# Altium project ST25RU3993_RF_MODULE.PrjPcb (part 3 of 4)

## Sheet Power_Amplifier_HP.SchDoc
size B; SheetNumber: 5; SheetTotal: 12; PageSetup: Record=PageOptions|CenterHorizontal=True|CenterVertical=True|PrintScale=0.97|XCorrection=1.00|YCorrection=1.00|PrintKind=0|BorderSize=5000000|LeftOffset=0|BottomOffset=0|Orientation=2|PaperLength=1000|PaperWidth=1000|Scale=100|PaperSource=7|PrintQuality=-4|MediaType=1|DitherType=10|PaperKind=A4|PrintScaleMode=1
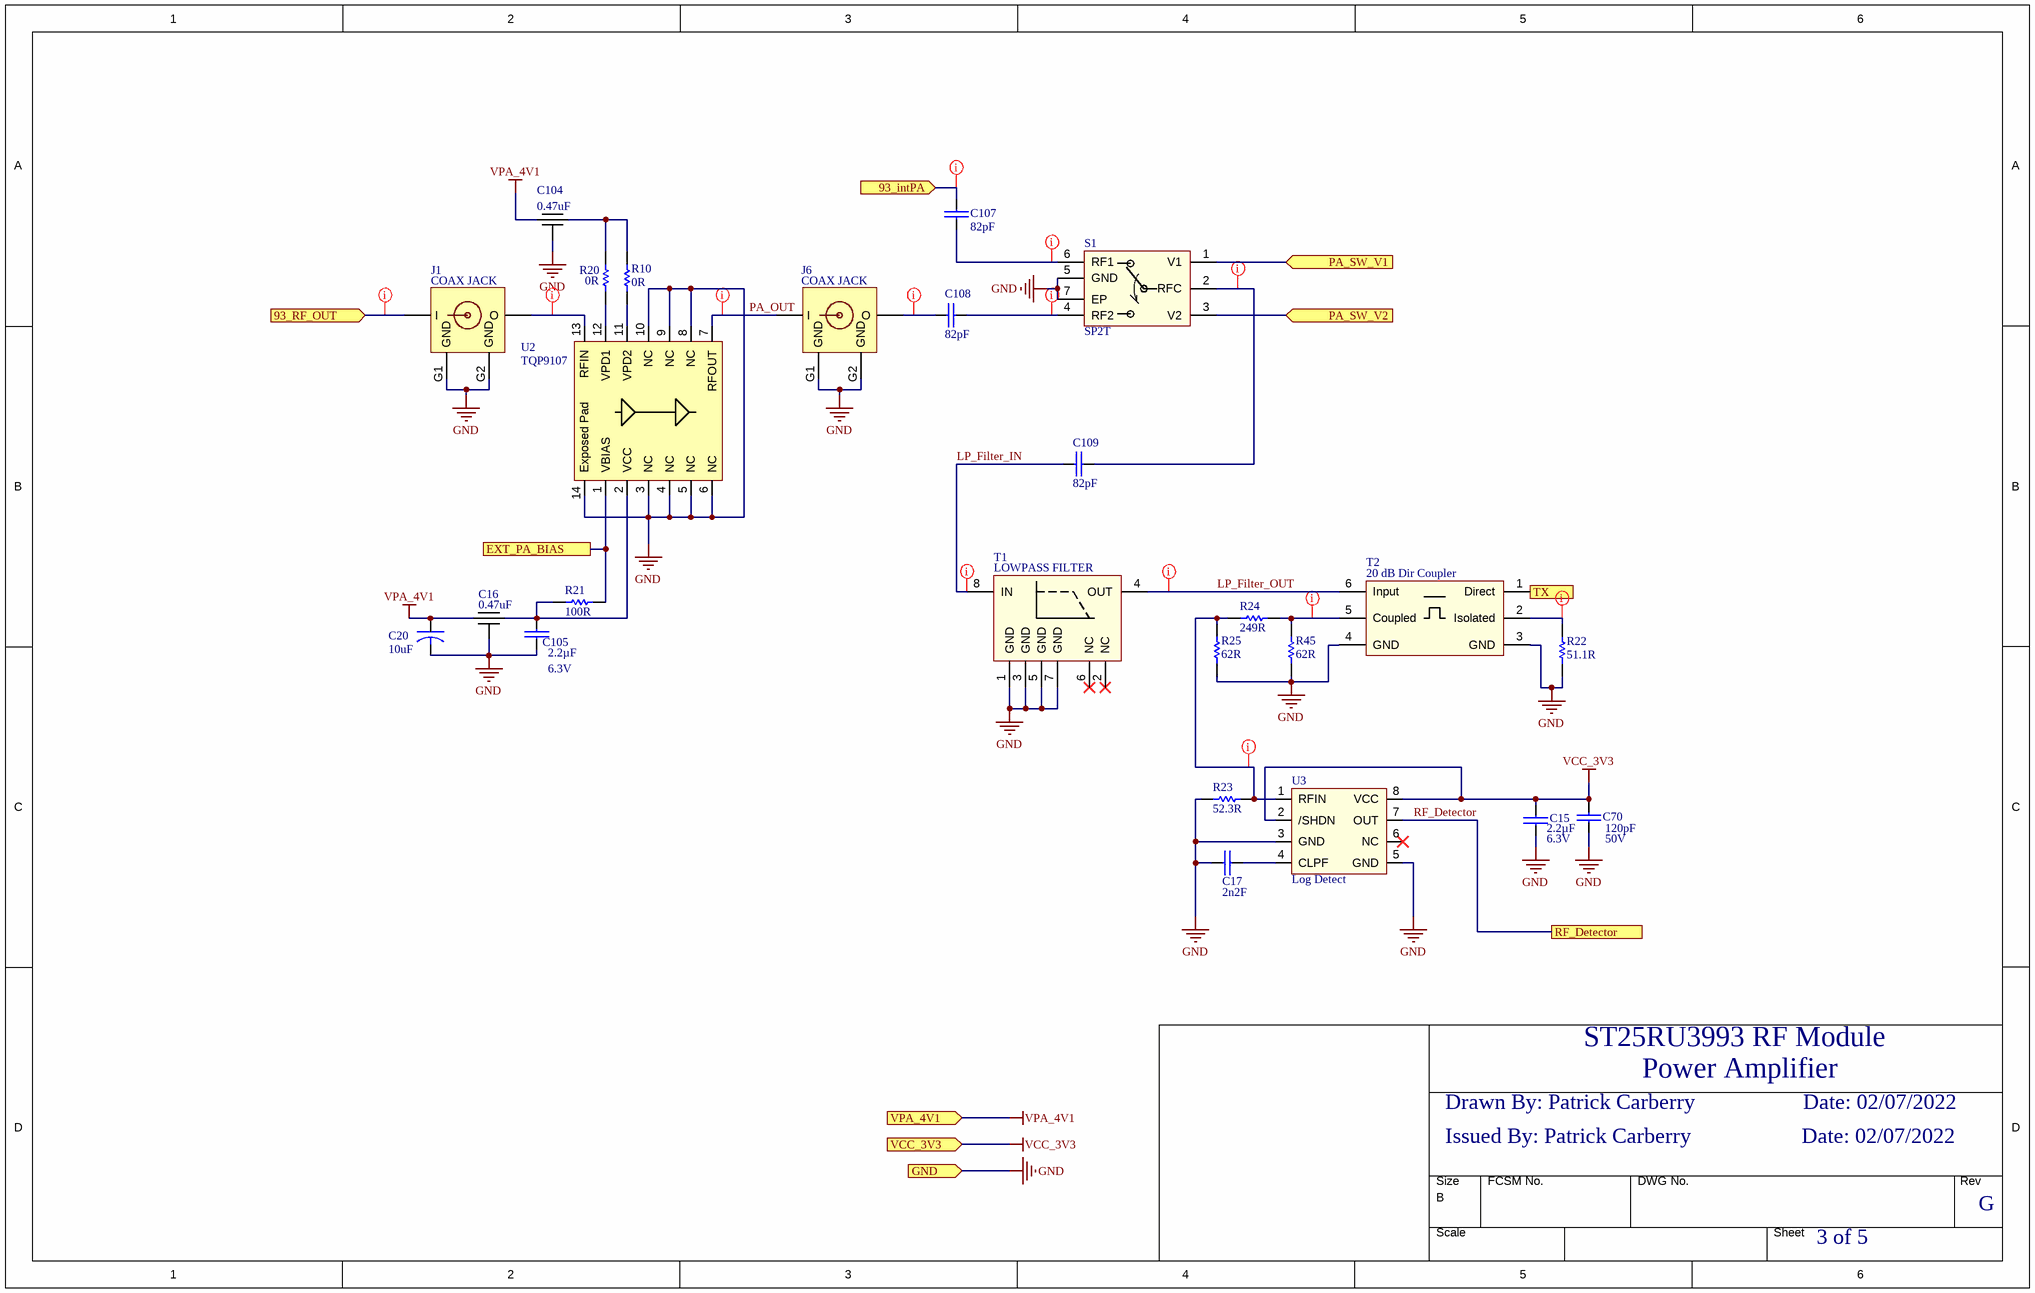
[diagram p2: Power_Amplifier_HP.SchDoc]

### Parts
C15  Capacitance: 2.2µF  Voltage - Rated: 6.3V  [C0402-RF]  (hidden comment: C0402C225K9PAC7867)
C16  0.47uF  [NFM18PS]
C17  2n2F  [C0402-RF]
C20  10uF  [2917(7343)]
C70  value 120pF  Voltage: 50V  [C0402-RF]  (hidden comment: C0402C121J5GACAUTO)
C104  0.47uF  [NFM18PS]
C105  Capacitance: 2.2µF  Voltage - Rated: 6.3V  [C0402-RF]  (hidden comment: C0402C225K9PAC7867)
C107  82pF  [C0402-RF]
C108  82pF  [C0402-RF]
C109  82pF  [C0402-RF]
J1  COAX JACK  [MS-156HF_SAW]
J6  COAX JACK  [MS-156HF]
R10  0R  [R0402-RF]
R20  0R  [R0402-RF]
R21  100R  [R0402-RF]
R22  51.1R  [R0402-RF]
R23  52.3R  [R0402-RF]
R24  249R  [R0402-RF]
R25  62R  [R0402-RF]
R45  62R  [R0402-RF]
S1  SP2T  [SKY13431-374LF]
T1  LOWPASS FILTER  [JTI-0900LP15B0063]
T2  20 dB Dir Coupler  [DC0710J5010AHF]
U2  TQP9107  [TQP9107]
U3  Log Detect  [MAX4003]

### Ports
93_intPA (in), 93_RF_OUT (in), EXT_PA_BIAS, GND (in), PA_SW_V1 (in), PA_SW_V2 (in), RF_Detector, TX (out), VCC_3V3 (in), VPA_4V1 (in)

### Nets
GND: C15.2 C16.2 C17.1 C20.2 C70.2 C104.2 C105.2 J1.G1(GND) J1.G2(GND) J6.G1(GND) J6.G2(GND) R22.1 R23.1 R25.1 R45.1 S1.5(GND) S1.7(EP) T1.1(GND) T1.3(GND) T1.5(GND) T1.7(GND) T2.3(GND) T2.4(GND) U2.3(NC) U2.4(NC) U2.5(NC) U2.6(NC) U2.8(NC) U2.9(NC) U2.10(NC) U2.14(Exposed_Pad) U3.3(GND) U3.5(GND) ; port GND
VCC_3V3: C15.1 C70.1 U3.2(/SHDN) U3.8(VCC) ; port VCC_3V3
VPA_4V1: C16.3 C20.1 C104.1 ; port VPA_4V1
LP_Filter_IN: C109.2 T1.8(IN)
LP_Filter_OUT: T1.4(OUT) T2.6(Input)
PA_OUT: J6.IN(I) U2.7(RFOUT)
PA_SW_V1: S1.1(V1) ; port PA_SW_V1
PA_SW_V2: S1.3(V2) ; port PA_SW_V2
RF_DETECTOR: U3.7(OUT) ; port RF_Detector
NetC16_1: C16.1 C105.1 R21.1 U2.2(VCC)
NetC17_2: C17.2 U3.4(CLPF)
NetC104_3: C104.3 R10.2 R20.2
NetC107_1: C107.1 ; port 93_intPA
NetC107_2: C107.2 S1.6(RF1)
NetC108_1: C108.1 S1.4(RF2)
NetC108_2: C108.2 J6.OUT(O)
NetC109_1: C109.1 S1.2(RFC)
NetJ1_IN: J1.IN(I) ; port 93_RF_OUT
NetJ1_OUT: J1.OUT(O) U2.13(RFIN)
NetR10_1: R10.1 U2.11(VPD2)
NetR20_1: R20.1 U2.12(VPD1)
NetR21_2: R21.2 U2.1(VBIAS) ; port EXT_PA_BIAS
NetR22_2: R22.2 T2.2(Isolated)
NetR23_2: R23.2 R24.1 R25.2 U3.1(RFIN)
NetR24_2: R24.2 R45.2 T2.5(Coupled)
NetT2_1: T2.1(Direct) ; port TX

Not connected (* = marked no-connect by the designer): T1 2(NC)* 6(NC)*; U3 6(NC)*

### Layout directives
net class SE_CPWG: LP_Filter_IN, LP_Filter_OUT, NetC107_1, NetC107_2, NetC108_1, NetC108_2, NetC109_1, NetJ1_IN, NetJ1_OUT, NetR22_2, NetR23_2, NetR24_2, PA_OUT

### Notes on the sheet
- Drawn By: Patrick Carberry
- ST25RU3993 RF Module
- Power Amplifier
- Date: 02/07/2022
- Issued By: Patrick Carberry
- 3 of 5
- G

### Library data of the parts
C15 C105 = CAP_2.2UF_6.3V_10%_X5R_0402: Manufacturer: KEMET; Tolerance: 10%; Temperature Coefficient: X5R; Thickness (Max): 0.014" (0.35mm); ComponentLink1URL: https://connect.kemet.com:7667/gateway/IntelliData-ComponentDocumentation/1.0/download/datasheet/C0402C225K9PACTU; ComponentLink1Description: http://www.murata.com/~/media/webrenewal/support/library/catalog/products/capacitor/mlcc/c02e.pdf; Manufacturer Part Number: C0402C225K9PAC7867
C16 C104 = NFM18PS474R0J3D: CAP FEEDTHRU 0.47UF 6.3V 0603; Manufacturer: Murata Electronics North America; Capacitance: 0.47µF; Tolerance: ±20%; Current: 2A; DC Resistance (DCR) (Max): 30 mOhm; Type: Polymer; ESR (Equivalent Series Resistance): 70 mOhm; Lifetime @ Temp.: 1000 Hrs @ 105°C; Ripple Current - High Frequency: 1A @ 100kHz; Surface Mount Land Size: 0.287" L x 0.169" W (7.30mm x 4.30mm); Exact Component Match: no; Supplier 1: Digi-Key; Manufacturer Part Number: NFM18PS474R0J3D; RoHS: RoHS Compliant; Category: Filters; Stock: 926; Pricing 1: 1=0.14, 10=0.132, 25=0.1264, 50=0.122, 100=0.1181, 250=0.11192, 500=0.09362, 1000=0.07267 (EUR); Packaging: Cut Tape (CT); Part Status: Active; Voltage - Rated: 6.3V; Operating Temperature: -55°C ~ 125°C; Insertion Loss: -; Temperature Coefficient: -; Ratings: -; Mounting Type: Surface Mount; Package / Case: 0603 (1608 Metric), 3 PC Pad; Size / Dimension: 0.063" L x 0.031" W (1.60mm x 0.80mm); Height (Max): 0.028" (0.70mm); Thread Size: -; ComponentLink1URL: http://search.murata.co.jp/Ceramy/image/img/A01X/G101/ENG/NFM18PS474R0J3-01.pdf; ComponentLink1Description: http://search.murata.co.jp/Ceramy/image/img/A01X/G101/ENG/NFM18PS474R0J3-01.pdf; Supplier Part Number 1: 490-6975-1-ND; Supplier 2: Digi-Key; Pricing 2: 1=1.25, 10=0.984, 100=0.7379, 500=0.55756, 1000=0.49196 (EUR); Applications: General Purpose; Ripple Current - Low Frequency: -; Lead Spacing: -; Height - Seated (Max): 0.075" (1.90mm); ComponentLink2URL: http://www.murata.com/~/media/webrenewal/support/library/catalog/products/capacitor/polymer/c90e.ashx; ComponentLink2Description: http://www.murata.com/~/media/webrenewal/support/library/catalog/products/capacitor/polymer/c90e.ashx; Supplier Part Number 2: 490-5481-1-ND
C17 = GRM155R71H222KA01D (2): CAP CER 2.2NF 50V X7R 0402; Manufacturer: Murata Electronics North America; Tolerance: ±10%; Notification: Current market demand for these product types have resulted in fluctuating and extending lead times. Lead times may differ.; Exact Component Match: no; Supplier 1: Digi-Key; Supplier Part Number 1: 490-1305-1-ND; Manufacturer Part Number: GRM155R71H222KA01D; RoHS: RoHS Compliant; Category: Capacitors; Stock: 254292; Pricing: 1=0.08, 10=0.013, 100=0.0054, 500=0.00386, 1000=0.00304, 2500=0.00276, 5000=0.00254 (EUR); Packaging: Cut Tape (CT); Part Status: Active; Voltage - Rated: 50V; Temperature Coefficient: X7R; Operating Temperature: -55°C ~ 125°C; Features: -; Ratings: -; Applications: General Purpose; Mounting Type: Surface Mount, MLCC; Package / Case: 0402 (1005 Metric); Size / Dimension: 0.039" L x 0.020" W (1.00mm x 0.50mm); Height - Seated (Max): -; Thickness (Max): 0.022" (0.55mm); Lead Spacing: -; Lead Style: -; ComponentLink1URL: https://www.murata.com/~/media/webrenewal/support/library/catalog/products/capacitor/mlcc/c02e.ashx?la=en-us; ComponentLink1Description: https://www.murata.com/~/media/webrenewal/support/library/catalog/products/capacitor/mlcc/c02e.ashx?la=en-us
C20 = ECASD41C106M060K00: CAP POLYMER 10UF 20% 16V SMD; Manufacturer: Murata; Product Training Modules: Polymer Aluminum Electrolytic Capacitors Using Murata's Polymer Aluminum Capacitors to Replace Tantalum; Catalog Drawings: ECAS Series End_D4 ECAS Series Side; Featured Product: ECAS Series Polymer Aluminum Electrolytic Capacitors; EDA / CAD Models: Download from Accelerated Designs; Capacitance: 10µF; ESR (Equivalent Series Resistance): 60 mOhm @ 100kHz; Lifetime @ Temp.: 1000 Hrs @ 105°C; Polarization: Polar; Ripple Current: 1A; Surface Mount Land Size: 0.287" L x 0.169" W (7.30mm x 4.30mm); Online Catalog: ECAS Series; Other Names: 490-5482-2; Supplier 2: Distrelec; Manufacturer Part Number: ECASD41C106M060K00; Stock: 2288; Pricing 1: 1=0.51, 50=0.46, 250=0.41 (EUR); Standard Package: 3,000; Category: Capacitors; Family: Aluminum - Polymer Capacitors; Series: ECAS; Packaging: Tape & Reel (TR); Tolerance: ±20%; Voltage Rating: 16V; Operating Temperature: -40°C ~ 105°C; Applications: General Purpose; Size / Dimension: 0.287" L x 0.169" W (7.30mm x 4.30mm); Height - Seated (Max): 0.075" (1.90mm); Mounting Type: Surface Mount; Package / Case: 2917 (7343 Metric); ComponentLink1URL: https://datasheet.ciiva.com/93/c90e-93987.pdf; ComponentLink1Description: https://datasheet.ciiva.com/93/c90e-93987.pdf; ComponentLink2URL: https://datasheet.ciiva.com/26889/getdatasheetpartid-716590-26889066.pdf; ComponentLink2Description: https://datasheet.ciiva.com/26889/getdatasheetpartid-716590-26889066.pdf; ComponentLink3URL: https://datasheet.ciiva.com/93/c90e-93985.pdf; ComponentLink3Description: https://datasheet.ciiva.com/93/c90e-93985.pdf; ComponentLink4URL: https://datasheet.ciiva.com/93/c90e-93986.pdf; ComponentLink4Description: https://datasheet.ciiva.com/93/c90e-93986.pdf; ComponentLink5URL: https://datasheet.ciiva.com/14113/ecas-eng-ds-14113434.pdf; ComponentLink5Description: https://datasheet.ciiva.com/14113/ecas-eng-ds-14113434.pdf; Supplier Part Number 2: 16705082; Supplier 1: Digi-Key; Supplier Part Number 1: 490-5482-1-ND
C70 = CAP_120PF_50V_5%_C0G_0402: CAP CER 120PF 50V C0G/NP0 0402; Manufacturer: KEMET; Manufacturer Part Number: C0402C121J5GACAUTO; ComponentLink1URL: https://content.kemet.com/datasheets/KEM_C1022_C0G_AUTO_SMD.pdf; ComponentLink1Description: http://search.murata.co.jp/Ceramy/image/img/A01X/G101/ENG/GRM0335C1H121JA01-01.pdf
C107-C109 = GRM1555C1H820GA01J: CAP CER 82PF 50V C0G/NP0 0402; Manufacturer: Murata Electronics North America; Tolerance: ±2%; Temperature Coefficient: C0G, NP0; Filter Type: Signal Line; Number of Lines: 1; Impedance @ Frequency: 1 kOhm @ 100MHz; Current Rating (Max): 250mA; DC Resistance (DCR) (Max): 1.1 Ohm; Type: Zener; Voltage - Reverse Standoff (Typ): 3V; Voltage - Breakdown (Min): 6V; Voltage - Clamping (Max) @ Ipp: 17V; Current - Peak Pulse (10/1000µs): 1A (8/20µs); Power - Peak Pulse: 40W; Power Line Protection: No; Capacitance @ Frequency: 0.4pF @ 200MHz ~ 3GHz; Supplier 1: Digi-Key; Supplier Part Number 1: 490-7760-1-ND; Manufacturer Part Number: GRM1555C1H820GA01J; RoHS: RoHS Compliant; Category: Capacitors; Stock: 52112; Pricing: 1=0.08, 10=0.042, 100=0.0189, 500=0.01352, 1000=0.01063, 2500=0.00966, 5000=0.00889 (EUR); Packaging: Cut Tape (CT); Part Status: Active; Voltage - Rated: 50V; Operating Temperature: -55°C ~ 125°C; Features: -; Ratings: -; Applications: General Purpose; Mounting Type: Surface Mount, MLCC; Package / Case: 0402 (1005 Metric); Size / Dimension: 0.039" L x 0.020" W (1.00mm x 0.50mm); Height - Seated (Max): -; Thickness (Max): 0.022" (0.55mm); Lead Spacing: -; Lead Style: -; ComponentLink1URL: http://www.murata.com/~/media/webrenewal/support/library/catalog/products/capacitor/mlcc/c02e.ashx; ComponentLink1Description: http://www.murata.com/~/media/webrenewal/support/library/catalog/products/capacitor/mlcc/c02e.ashx; Supplier 2: Digi-Key; Supplier Part Number 2: 490-3999-1-ND; Height (Max): 0.022" (0.55mm); ComponentLink2URL: http://www.murata.com/en-global/products/productdata/8796740223006/ENFA0024.pdf; ComponentLink2Description: http://www.murata.com/en-global/products/productdata/8796740223006/ENFA0024.pdf; Supplier 3: Digi-Key; Supplier Part Number 3: 497-13413-1-ND; Supplier Device Package: SOD-882T; ComponentLink3URL: http://www.st.com/content/ccc/resource/technical/document/datasheet/e8/d2/ed/fd/e8/00/4a/29/DM00065056.pdf/files/DM00065056.pdf/jcr:content/translations/en.DM00065056.pdf; ComponentLink3Description: http://www.st.com/content/ccc/resource/technical/document/datasheet/e8/d2/ed/fd/e8/00/4a/29/DM00065056.pdf/files/DM00065056.pdf/jcr:content/translations/en.DM00065056.pdf; Exact Component Match: no
J1 = MS-156HF_SAW: CONN COAX JACK STR 50 OHM SMD; Manufacturer 1: Hirose Electric Co Ltd; Manufacturer Part Number 1: MS-156HF(01); Connector Style: Coaxial Switch - 4mm Plug Dia; Connector Type: Receptacle, Female Socket; Contact Termination: Solder; Impedance: 50 Ohm; Frequency - Max: 6GHz; Body Material: Phosphor Bronze; Body Finish: Gold; Center Contact Material: Beryllium Copper; Dielectric Material: Polyamide (PA), Nylon 6T; Coupler Type: Standard; Frequency: 700MHz ~ 1GHz; Coupling Factor: 10.9dB; Insertion Loss: 0.21dB; Power - Max: 2W; Return Loss: 17.5dB; Exact Component Match: no; Capacitance: 2.2µF; Tolerance: ±20%; Voltage - Rated: 10V; Current: 4A; DC Resistance (DCR) (Max): 10 mOhm; Material - Core: Air; Shielding: Unshielded; DC Resistance (DCR): 1.25 Ohm Max; Supplier 1: Digi-Key; Supplier Part Number 1: H11669-ND; RoHS: RoHS Compliant; Category: Connectors, Interconnects; Stock 1: 10; Pricing 1: 1=0.84, 10=0.735, 25=0.6912, 50=0.6626, 100=0.6337, 250=0.57612, 500=0.51852, 1000=0.4609, 2500=0.41769 (EUR); Packaging: Bulk; Part Status: Active; Shield Termination: Solder; Mounting Type: Surface Mount; Cable Group: -; Fastening Type: Snap-On; Features: Internal Switch; Housing Color: Gold; Ingress Protection: -; Center Contact Plating: Gold; Voltage Rating: -; Operating Temperature: -40°C ~ 85°C; ComponentLink1URL: https://www.hirose.com/product/en/download_file/key_name/MS-156HF/category/Catalog/doc_file_id/49714/?file_category_id=4&item_id=394&is_series=1; ComponentLink1Description: https://www.hirose.com/product/en/download_file/key_name/MS-156HF/category/Catalog/doc_file_id/49714/?file_category_id=4&item_id=394&is_series=1; Supplier 2: Digi-Key; Supplier Part Number 2: 1173-1084-1-ND; Manufacturer 2: Anaren; Manufacturer Part Number 2: DC0710J5010AHF; Stock 2: 8788; Pricing 2: 1=0.82, 10=0.735, 25=0.648, 100=0.5833, 250=0.50772, 500=0.4537 (EUR); Applications: General Purpose; Isolation: -; Package / Case: 0805 (2012 Metric); Supplier Device Package: 0805; ComponentLink2URL: https://www.anaren.com/sites/default/files/Part-Datasheets/DC0710J5010AHF_Datasheet_RevA.pdf; ComponentLink2Description: https://www.anaren.com/sites/default/files/Part-Datasheets/DC0710J5010AHF_Datasheet_RevA.pdf; Manufacturer: Hirose Electric Co Ltd; Manufacturer Part Number: MS-156HF(01); Supplier 3: Digi-Key; Stock: 3361; Pricing 3: 1=0.25, 10=0.237, 25=0.2256, 50=0.2184, 100=0.2112, 250=0.20028, 500=0.1675, 1000=0.12999 (EUR); Temperature Coefficient: -; Ratings: -; Size / Dimension: 0.063" L x 0.031" W (1.60mm x 0.80mm); Height (Max): 0.028" (0.70mm); Thread Size: -; ComponentLink3URL: http://search.murata.co.jp/Ceramy/image/img/A01X/G101/ENG/NFM18PC225B1A3-01.pdf; ComponentLink3Description: http://search.murata.co.jp/Ceramy/image/img/A01X/G101/ENG/NFM18PC225B1A3-01.pdf; Supplier 4: Digi-Key; Supplier Part Number 4: 490-15137-1-ND; Pricing: 1=0.08, 10=0.064, 100=0.0424, 500=0.0354, 1000=0.02973, 2500=0.02548 (EUR); Type: Multilayer; Height - Seated (Max): 0.022" (0.55mm); ComponentLink4URL: http://search.murata.co.jp/Ceramy/image/img/P02/JELF243B-0010.pdf; ComponentLink4Description: http://search.murata.co.jp/Ceramy/image/img/P02/JELF243B-0010.pdf; Supplier Part Number 3: 490-6972-1-ND
J6 = MS-156HF: CONN COAX JACK STR 50 OHM SMD; Manufacturer 1: Hirose Electric Co Ltd; Manufacturer Part Number 1: MS-156HF(01); Connector Style: Coaxial Switch - 4mm Plug Dia; Connector Type: Receptacle, Female Socket; Contact Termination: Solder; Impedance: 50 Ohm; Frequency - Max: 6GHz; Body Material: Phosphor Bronze; Body Finish: Gold; Center Contact Material: Beryllium Copper; Dielectric Material: Polyamide (PA), Nylon 6T; Coupler Type: Standard; Frequency: 700MHz ~ 1GHz; Coupling Factor: 10.9dB; Insertion Loss: 0.21dB; Power - Max: 2W; Return Loss: 17.5dB; Exact Component Match: no; Supplier 1: Digi-Key; Supplier Part Number 1: H11669-ND; RoHS: RoHS Compliant; Category: Connectors, Interconnects; Stock 1: 10; Pricing 1: 1=0.84, 10=0.735, 25=0.6912, 50=0.6626, 100=0.6337, 250=0.57612, 500=0.51852, 1000=0.4609, 2500=0.41769 (EUR); Packaging: Bulk; Part Status: Active; Shield Termination: Solder; Mounting Type: Surface Mount; Cable Group: -; Fastening Type: Snap-On; Features: Internal Switch; Housing Color: Gold; Ingress Protection: -; Center Contact Plating: Gold; Voltage Rating: -; Operating Temperature: -40°C ~ 85°C; ComponentLink1URL: https://www.hirose.com/product/en/download_file/key_name/MS-156HF/category/Catalog/doc_file_id/49714/?file_category_id=4&item_id=394&is_series=1; ComponentLink1Description: https://www.hirose.com/product/en/download_file/key_name/MS-156HF/category/Catalog/doc_file_id/49714/?file_category_id=4&item_id=394&is_series=1; Supplier 2: Digi-Key; Supplier Part Number 2: 1173-1084-1-ND; Manufacturer 2: Anaren; Manufacturer Part Number 2: DC0710J5010AHF; Stock 2: 8788; Pricing 2: 1=0.82, 10=0.735, 25=0.648, 100=0.5833, 250=0.50772, 500=0.4537 (EUR); Applications: General Purpose; Isolation: -; Package / Case: 0805 (2012 Metric); Supplier Device Package: 0805; ComponentLink2URL: https://www.anaren.com/sites/default/files/Part-Datasheets/DC0710J5010AHF_Datasheet_RevA.pdf; ComponentLink2Description: https://www.anaren.com/sites/default/files/Part-Datasheets/DC0710J5010AHF_Datasheet_RevA.pdf; Manufacturer: Hirose Electric Co Ltd; Manufacturer Part Number: MS-156HF(01)
R10 R20 = RC0402JR-070RL: RES SMD 0.0OHM JUMPER 1/16W 0402; Manufacturer: Yageo; Resistance (Ohms): 0.0; Power (Watts): 0.063W, 1/16W; Exact Component Match: no; Supplier 1: Digi-Key; Supplier Part Number 1: 311-0.0JRDKR-ND; Manufacturer Part Number: RC0402JR-070RL; RoHS: RoHS Compliant; Category: Resistors; Stock 1: 13423202; Pricing 1: 1=0.09, 10=0.012, 25=0.0084, 100=0.0048, 250=0.0036, 500=0.00288, 1000=0.00212, 2500=0.00184, 5000=0.00152 (EUR); Packaging: Digi-Reel®; Part Status: Active; Tolerance: Jumper; Composition: Thick Film; Features: Moisture Resistant; Temperature Coefficient: -; Operating Temperature: -55°C ~ 155°C; Package / Case: 0402 (1005 Metric); Supplier Device Package: 0402; Size / Dimension: 0.039" L x 0.020" W (1.00mm x 0.50mm); Height - Seated (Max): 0.016" (0.40mm); Number of Terminations: 2; Failure Rate: -; ComponentLink1URL: http://www.yageo.com/NewPortal/yageodocoutput?fileName=/pdf/R-Chip/PYu-RC_Group_51_RoHS_L_4.pdf; ComponentLink1Description: http://www.yageo.com/NewPortal/yageodocoutput?fileName=/pdf/R-Chip/PYu-RC_Group_51_RoHS_L_4.pdf; Manufacturer 1: Yageo; Manufacturer Part Number 1: RC0402JR-070RL
R21 = RC0402FR-07100RL: RES SMD 100 OHM 1% 1/16W 0402; Manufacturer: Yageo; Resistance (Ohms): 100; Power (Watts): 0.063W, 1/16W; Temperature Coefficient: ±100ppm/°C; Exact Component Match: no; Supplier 1: Digi-Key; Supplier Part Number 1: 311-100LRCT-ND; Manufacturer Part Number: RC0402FR-07100RL; RoHS: RoHS Compliant; Category: Resistors; Stock 1: 1895343; Pricing 1: 1=0.09, 10=0.012, 25=0.0088, 100=0.0049, 250=0.00372, 500=0.00296, 1000=0.00218, 2500=0.00189, 5000=0.00156 (EUR); Packaging: Cut Tape (CT); Part Status: Active; Tolerance: ±1%; Composition: Thick Film; Features: Moisture Resistant; Operating Temperature: -55°C ~ 155°C; Package / Case: 0402 (1005 Metric); Supplier Device Package: 0402; Size / Dimension: 0.039" L x 0.020" W (1.00mm x 0.50mm); Height - Seated (Max): 0.016" (0.40mm); Number of Terminations: 2; Failure Rate: -; ComponentLink1URL: http://www.yageo.com/NewPortal/yageodocoutput?fileName=/pdf/R-Chip/PYu-RC_Group_51_RoHS_L_4.pdf; ComponentLink1Description: http://www.yageo.com/NewPortal/yageodocoutput?fileName=/pdf/R-Chip/PYu-RC_Group_51_RoHS_L_4.pdf; Manufacturer 1: Yageo; Manufacturer Part Number 1: RC0402FR-07100RL
R22 = RC0402FR-0751R1L: RES SMD 51.1 OHM 1% 1/16W 0402; Manufacturer: Yageo; Power (Watts): 0.063W, 1/16W; Temperature Coefficient: ±100ppm/°C; Exact Component Match: no; Supplier 1: Digi-Key; Supplier Part Number 1: 311-51.1LRCT-ND; Manufacturer Part Number: RC0402FR-0751R1L; RoHS: RoHS Compliant; Category: Resistors; Stock: 237958; Pricing: 1=0.08, 10=0.012, 100=0.0048, 1000=0.00215, 2500=0.00186, 5000=0.00154 (EUR); Packaging: Cut Tape (CT); Part Status: Active; Tolerance: ±1%; Composition: Thick Film; Features: Moisture Resistant; Operating Temperature: -55°C ~ 155°C; Package / Case: 0402 (1005 Metric); Supplier Device Package: 0402; Size / Dimension: 0.039" L x 0.020" W (1.00mm x 0.50mm); Height - Seated (Max): 0.016" (0.40mm); Failure Rate: -; ComponentLink1URL: http://www.yageo.com/documents/recent/PYu-RC_Group_51_RoHS_L_7.pdf; ComponentLink1Description: http://www.yageo.com/documents/recent/PYu-RC_Group_51_RoHS_L_7.pdf
R23 = ERJ2RKF52R3X: RES SMD 52R3 1% 0.1W 0402; Manufacturer: Panasonic Electronic Components; Manufacturer Part Number: ERJ-2RKF52R3X; Power (Watts): 0.1W, 1/10W; Temperature Coefficient: ±100ppm/°C; Exact Component Match: no; Supplier 1: Digi-Key; Supplier Part Number 1: P52.3LCT-ND; RoHS: RoHS Compliant; Category: Resistors; Stock: 2033; Pricing: 1=0.08, 10=0.036, 100=0.0147, 1000=0.00662, 2500=0.00574, 5000=0.00474 (EUR); Packaging: Cut Tape (CT); Part Status: Active; Tolerance: ±1%; Composition: Thick Film; Features: Automotive AEC-Q200; Operating Temperature: -55°C ~ 155°C; Package / Case: 0402 (1005 Metric); Supplier Device Package: 0402; Size / Dimension: 0.039" L x 0.020" W (1.00mm x 0.50mm); Height - Seated (Max): 0.016" (0.40mm); Failure Rate: -; ComponentLink1URL: https://industrial.panasonic.com/cdbs/www-data/pdf/RDA0000/AOA0000C304.pdf; ComponentLink1Description: https://industrial.panasonic.com/cdbs/www-data/pdf/RDA0000/AOA0000C304.pdf
R24 = RC0402FR-07249RL: RES SMD 249 OHM 1% 1/16W 0402; Manufacturer: Yageo; Power (Watts): 0.063W, 1/16W; Temperature Coefficient: ±100ppm/°C; Exact Component Match: no; Supplier 1: Digi-Key; Supplier Part Number 1: 311-249LRCT-ND; Manufacturer Part Number: RC0402FR-07249RL; RoHS: RoHS Compliant; Category: Resistors; Stock: 376482; Pricing: 1=0.08, 10=0.012, 100=0.0048, 1000=0.00215, 2500=0.00186, 5000=0.00154 (EUR); Packaging: Cut Tape (CT); Part Status: Active; Tolerance: ±1%; Composition: Thick Film; Features: Moisture Resistant; Operating Temperature: -55°C ~ 155°C; Package / Case: 0402 (1005 Metric); Supplier Device Package: 0402; Size / Dimension: 0.039" L x 0.020" W (1.00mm x 0.50mm); Height - Seated (Max): 0.016" (0.40mm); Failure Rate: -; ComponentLink1URL: http://www.yageo.com/documents/recent/PYu-RC_Group_51_RoHS_L_7.pdf; ComponentLink1Description: http://www.yageo.com/documents/recent/PYu-RC_Group_51_RoHS_L_7.pdf
R25 R45 = RC0402FR-0762RL: RES SMD 62 OHM 1% 1/16W 0402; Manufacturer: Yageo; Power (Watts): 0.063W, 1/16W; Temperature Coefficient: ±100ppm/°C; Exact Component Match: no; Supplier 1: Digi-Key; Supplier Part Number 1: 311-62.0LRCT-ND; Manufacturer Part Number: RC0402FR-0762RL; RoHS: RoHS Compliant; Category: Resistors; Stock: 191216; Pricing: 1=0.08, 10=0.012, 100=0.0048, 1000=0.00215, 2500=0.00186, 5000=0.00154 (EUR); Packaging: Cut Tape (CT); Part Status: Active; Tolerance: ±1%; Composition: Thick Film; Features: Moisture Resistant; Operating Temperature: -55°C ~ 155°C; Package / Case: 0402 (1005 Metric); Supplier Device Package: 0402; Size / Dimension: 0.039" L x 0.020" W (1.00mm x 0.50mm); Height - Seated (Max): 0.016" (0.40mm); Failure Rate: -; ComponentLink1URL: http://www.yageo.com/documents/recent/PYu-RC_Group_51_RoHS_L_7.pdf; ComponentLink1Description: http://www.yageo.com/documents/recent/PYu-RC_Group_51_RoHS_L_7.pdf
S1 = SKY13431-374LF: IC SWITCH SP2T; Manufacturer: Skyworks Solutions Inc.; Frequency - Lower: 500MHz; Isolation @ Frequency: 20dB @ 5.8GHz (typ); Insertion Loss @ Frequency: 0.8dB @ 5.8GHz; IIP3: 57dBm (typ); Circuit: SPDT; P1dB: 36dBm; Impedance: 50 Ohm; Voltage - Supply: 2.5 V ~ 5 V; RF Type: WiMax, WLAN; Exact Component Match: no; Supplier 1: Digi-Key; Supplier Part Number 1: 863-1651-1-ND; Manufacturer Part Number: SKY13431-374LF; RoHS: RoHS Compliant; Category: RF/IF and RFID; Stock: 3887; Pricing: 1=1.28, 10=1.144, 100=0.8921, 500=0.73694, 1000=0.5818 (EUR); Packaging: Cut Tape (CT); Part Status: Active; Topology: -; Features: -; Operating Temperature: -40°C ~ 85°C; Package / Case: 6-XFDFN Exposed Pad; Supplier Device Package: 6-DFN (1.5x1.5); ComponentLink1URL: http://www.skyworksinc.com/uploads/documents/SKY13431_374LF_201649C.pdf; ComponentLink1Description: http://www.skyworksinc.com/uploads/documents/SKY13431_374LF_201649C.pdf
T1 = 0900LP15B0063: FILTER LOWPASS 863-960MHZ; Manufacturer: Johanson Technology Inc.; Manufacturer Part Number: 0900LP15B0063E; Exact Component Match: no; Supplier 1: Digi-Key; Supplier Part Number 1: 712-1635-1-ND; RoHS: RoHS Compliant; Category: Filters; Stock: 11994; Pricing: 1=0.44, 10=0.404, 25=0.3852, 50=0.373, 100=0.3605, 250=0.34176, 500=0.28586, 1000=0.22184 (EUR); Part Status: Active; ComponentLink1URL: https://www.johansontechnology.com/datasheets/low-pass-filters/0900LP15B0063.pdf; ComponentLink1Description: https://www.johansontechnology.com/datasheets/low-pass-filters/0900LP15B0063.pdf
T2 = DC0710J5020AHF: COUPLER 20DB 700-1000MHZ 0805; Manufacturer: Anaren; Frequency: 700MHz; Insertion Loss: 0.22dB; Max Power Dissipation: 2W; Return Loss: 21.41dB; Manufacturer Part Number: DC0710J5020AHF; Stock 1: 12905; RoHS: Yes; Mount: Surface Mount; Case/Package: 0805; Number of Pins: 6; Case Code (Metric): 2012; Case Code (Imperial): 0805; Contact Plating: Gold; Min Operating Temperature: -55°C; Max Operating Temperature: 85°C; Package Quantity: 4000; Packaging: Tape and Reel; Termination: SMD/SMT; ComponentLink1URL: https://datasheet.ciiva.com/2794/dc0710j5020ahf-data20sheet-revd-2794214.pdf?src-supplier=Digi-Key; ComponentLink1Description: https://datasheet.ciiva.com/2794/dc0710j5020ahf-data20sheet-revd-2794214.pdf?src-supplier=Digi-Key; ComponentLink2URL: https://datasheet.ciiva.com/4548/dc0710j5020ahf-data20sheet-revd-26973-4548407.pdf?src-supplier=Mouser; ComponentLink2Description: https://datasheet.ciiva.com/4548/dc0710j5020ahf-data20sheet-revd-26973-4548407.pdf?src-supplier=Mouser; ComponentLink3URL: https://datasheet.ciiva.com/2794/dc0710j5020ahf-datasheet-revd-2794215.pdf?src-supplier=Digi-Key; ComponentLink3Description: https://datasheet.ciiva.com/2794/dc0710j5020ahf-datasheet-revd-2794215.pdf?src-supplier=Digi-Key; ComponentLink4URL: https://datasheet.ciiva.com/15213/getdatasheetpartid-559400-15213447.pdf?src-supplier=Verical; ComponentLink4Description: https://datasheet.ciiva.com/15213/getdatasheetpartid-559400-15213447.pdf?src-supplier=Verical; ComponentLink5URL: https://datasheet.ciiva.com/2794/dc0710j5020ahf-datasheet-revd-2794216.pdf?src-supplier=Digi-Key; ComponentLink5Description: https://datasheet.ciiva.com/2794/dc0710j5020ahf-datasheet-revd-2794216.pdf?src-supplier=Digi-Key; Supplier 1: Digi-Key; Supplier Part Number 1: 1173-1085-1-ND
U2 = TQP9107: 699 – 960 MHz 2-stage Power Amplifier; Manufacturer: Qorvo; Supplier 1: Mouser; Supplier Part Number 1: 772-TQP9107; Manufacturer Part Number: TQP9107; Stock: 1110; Pricing: 10000=3.63 (USD)
U3 = MAX4003EUA+T: IC LOG AMP RF DETECT 45DB 8-MSOP; Manufacturer: Maxim Integrated; Frequency: 100MHz ~ 2.5GHz; RF Type: Cellular, TDMA, CDMA, GPRS, GSM; Input Range: -45dBm ~ 0dBm; Voltage - Supply: 2.7 V ~ 5 V; Exact Component Match: no; Supplier 1: Digi-Key; Supplier Part Number 1: MAX4003EUA+TCT-ND; Manufacturer Part Number: MAX4003EUA+T; RoHS: RoHS Compliant; Category: RF/IF and RFID; Stock: 3148; Pricing: 1=2.36, 10=2.23, 25=1.7836, 50=1.6944, 100=1.5606, 250=1.48032, 500=1.4268 (EUR); Packaging: Cut Tape (CT); Part Status: Active; Accuracy: -; Package / Case: 8-TSSOP, 8-MSOP (0.118", 3.00mm Width); Supplier Device Package: 8-uMAX; ComponentLink1URL: http://datasheets.maximintegrated.com/en/ds/MAX4003.pdf; ComponentLink1Description: http://datasheets.maximintegrated.com/en/ds/MAX4003.pdf

## Sheet Carrier_Cancellation_HP.SchDoc
size B; SheetNumber: 6; SheetTotal: 12; PageSetup: Record=PageOptions|CenterHorizontal=True|CenterVertical=True|PrintScale=0.97|XCorrection=1.00|YCorrection=1.00|PrintKind=0|BorderSize=5000000|LeftOffset=0|BottomOffset=0|Orientation=2|PaperLength=1000|PaperWidth=1000|Scale=100|PaperSource=7|PrintQuality=-4|MediaType=1|DitherType=10|PaperKind=A4|PrintScaleMode=1
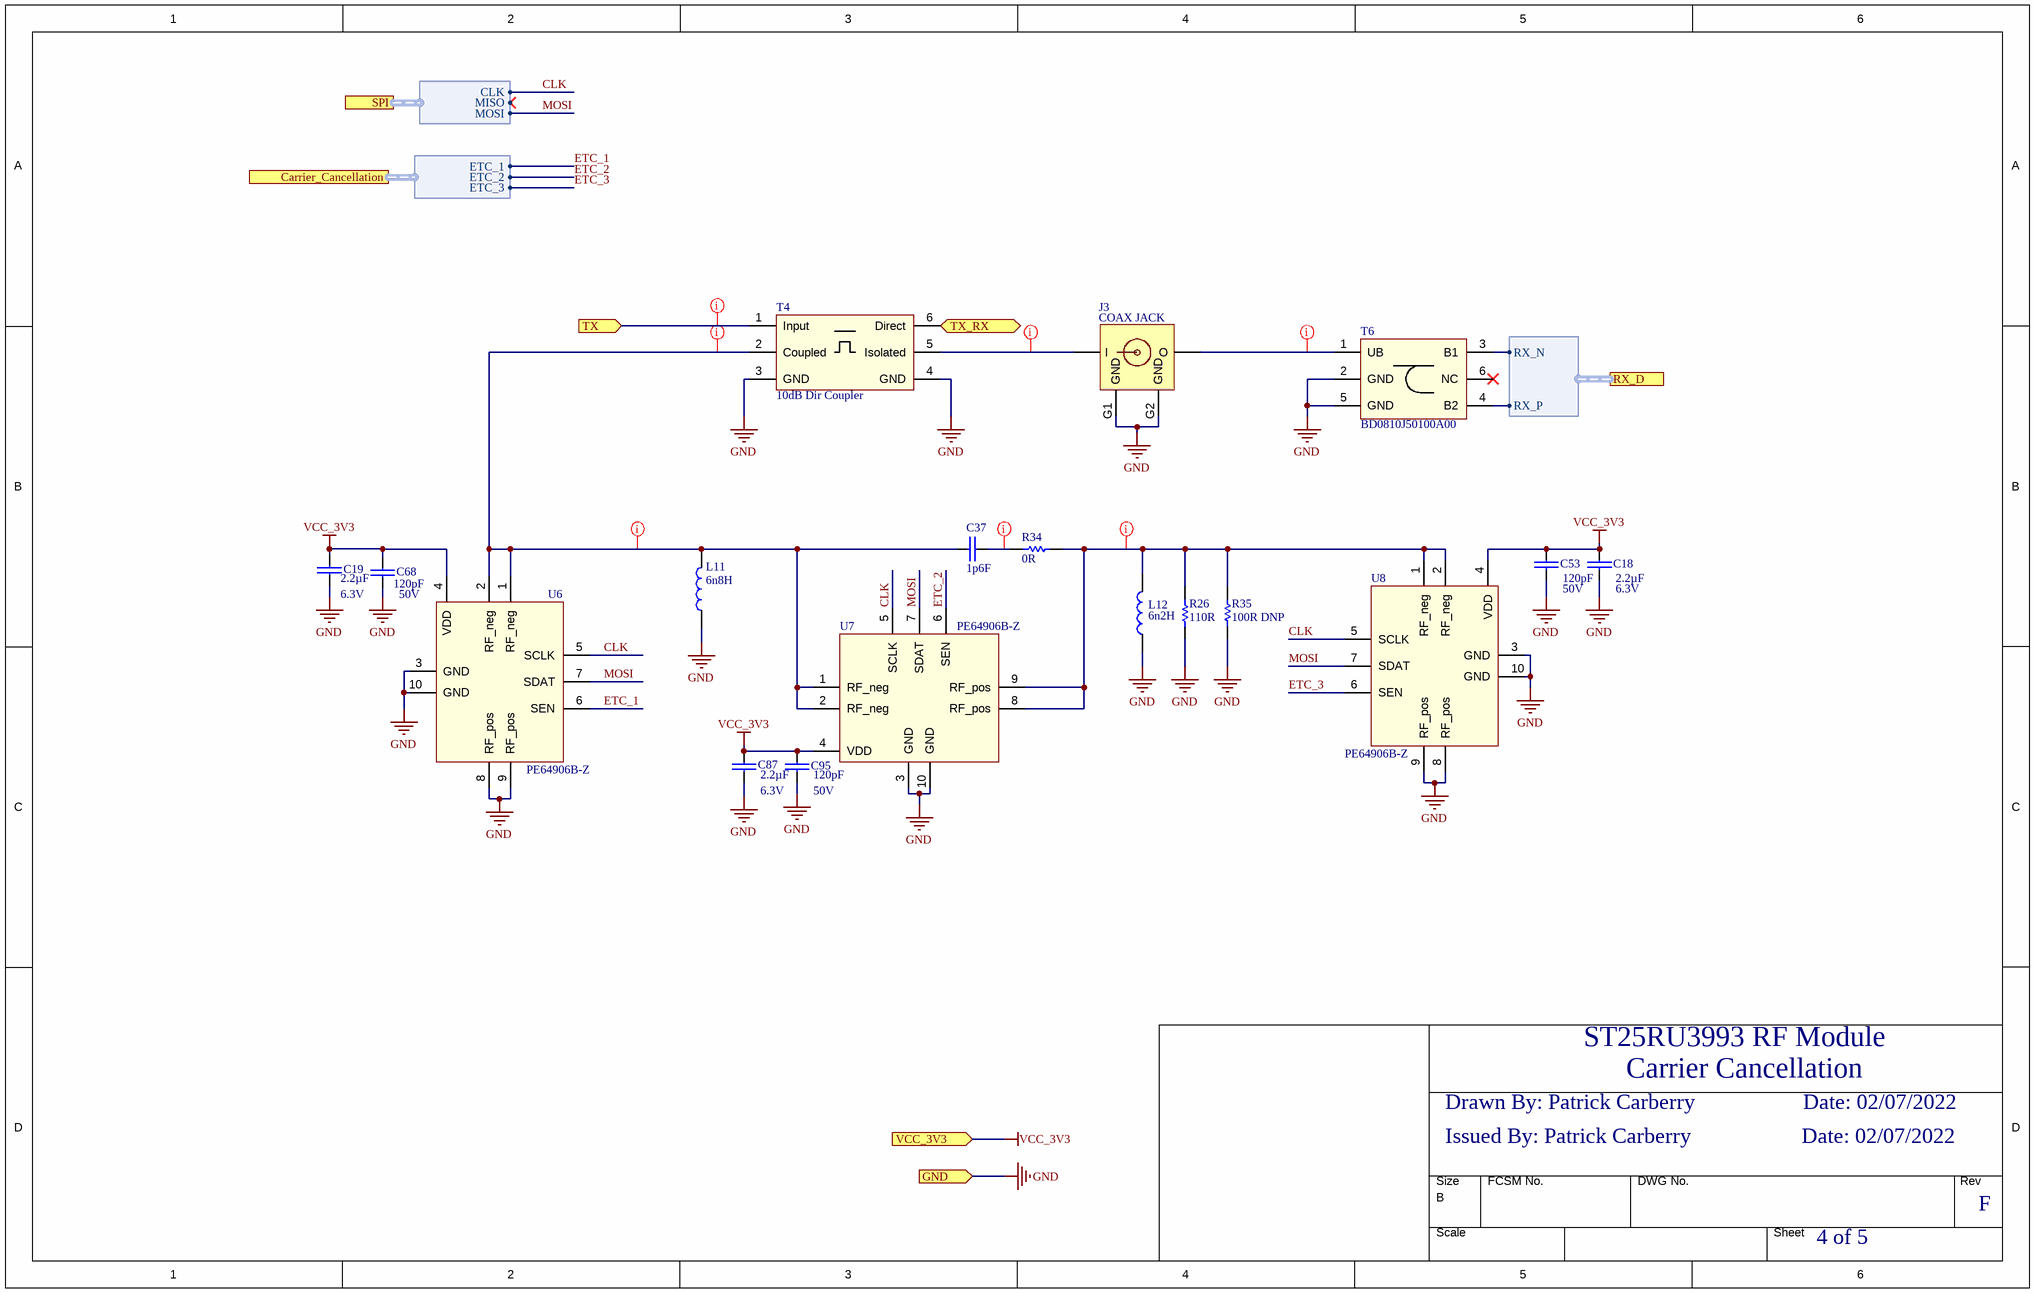
[diagram p3: Carrier_Cancellation_HP.SchDoc]

### Parts
C18  Capacitance: 2.2µF  Voltage - Rated: 6.3V  [C0402-RF]  (hidden comment: C0402C225K9PAC7867)
C19  Capacitance: 2.2µF  Voltage - Rated: 6.3V  [C0402-RF]  (hidden comment: C0402C225K9PAC7867)
C37  1p6F  [C0402-RF]
C53  value 120pF  Voltage: 50V  [C0402-RF]  (hidden comment: C0402C121J5GACAUTO)
C68  value 120pF  Voltage: 50V  [C0402-RF]  (hidden comment: C0402C121J5GACAUTO)
C87  Capacitance: 2.2µF  Voltage - Rated: 6.3V  [C0402-RF]  (hidden comment: C0402C225K9PAC7867)
C95  value 120pF  Voltage: 50V  [C0402-RF]  (hidden comment: C0402C121J5GACAUTO)
J3  COAX JACK  [MS-156HF]
L11  6n8H  [L0402-RF]
L12  6n2H  [L0402-RF]
R26  110R  [R0402-RF]
R34  0R  [R0402-RF]
R35  100R DNP  [R0402-RF]  (no BOM)
T4  10dB Dir Coupler  [DC0710J5010AHF]
T6  BD0810J50100A00  [BD0810J50100AHF]
U6  PE64906B-Z  [PE62304]
U7  PE64906B-Z  [PE62304]
U8  PE64906B-Z  [PE62304]

### Ports
Carrier_Cancellation (harness Harness_CC), GND (in), RX_D (harness Harness_RX_D), SPI (harness Harness_SPI), TX (in), TX_RX (bidir), VCC_3V3 (in)

### Harnesses
Harness_RX_D: RX_P, RX_N
Harness_CC: ETC_1, ETC_2, ETC_3
Harness_SPI: MISO, MOSI, CLK

### Nets
GND: C18.2 C19.2 C53.2 C68.2 C87.2 C95.2 J3.G1(GND) J3.G2(GND) L11.1 L12.1 R26.1 R35.1 T4.3(GND) T4.4(GND) T6.2(GND) T6.5(GND) U6.3(GND) U6.8(RF_pos) U6.9(RF_pos) U6.10(GND) U7.3(GND) U7.10(GND) U8.3(GND) U8.8(RF_pos) U8.9(RF_pos) U8.10(GND) ; port GND
VCC_3V3: C18.1 C19.1 C53.1 C68.1 C87.1 C95.1 U6.4(VDD) U7.4(VDD) U8.4(VDD) ; port VCC_3V3
CLK: U6.5(SCLK) U7.5(SCLK) U8.5(SCLK) ; port SPI.CLK
ETC_1: U6.6(SEN) ; port Carrier_Cancellation.ETC_1
ETC_2: U7.6(SEN) ; port Carrier_Cancellation.ETC_2
ETC_3: U8.6(SEN) ; port Carrier_Cancellation.ETC_3
MOSI: U6.7(SDAT) U7.7(SDAT) U8.7(SDAT) ; port SPI.MOSI
RX_N: T6.3(B1) ; port RX_D.RX_N
RX_P: T6.4(B2) ; port RX_D.RX_P
NetC37_1: C37.1 L11.2 T4.2(Coupled) U6.1(RF_neg) U6.2(RF_neg) U7.1(RF_neg) U7.2(RF_neg)
NetC37_2: C37.2 R34.1
NetC112_2: T4.6(Direct) ; port TX_RX
NetJ3_IN: J3.IN(I) T4.5(Isolated)
NetJ3_OUT: J3.OUT(O) T6.1(UB)
NetL12_2: L12.2 R26.2 R34.2 R35.2 U7.8(RF_pos) U7.9(RF_pos) U8.1(RF_neg) U8.2(RF_neg)
NetT2_1: T4.1(Input) ; port TX

Not connected (* = marked no-connect by the designer): T6 6(NC)*

### Layout directives
net class SE_CPWG: NetC37_1, NetC37_2, NetJ3_IN, NetJ3_OUT, NetL12_2, NetT2_1

### Notes on the sheet
- Drawn By: Patrick Carberry
- ST25RU3993 RF Module
- Carrier Cancellation
- Date: 02/07/2022
- Issued By: Patrick Carberry
- 4 of 5
- F

### Library data of the parts
C18 C19 C87 = CAP_2.2UF_6.3V_10%_X5R_0402: as C15 on sheet Power_Amplifier_HP; Thickness (Max): 0.014" (0.35mm); ComponentLink1URL: https://connect.kemet.com:7667/gateway/IntelliData-ComponentDocumentation/1.0/download/datasheet/C0402C225K9PACTU; ComponentLink1Description: http://www.murata.com/~/media/webrenewal/support/library/catalog/products/capacitor/mlcc/c02e.pdf; Manufacturer Part Number: C0402C225K9PAC7867
C37 = GRM1555C1H3R6BA01D: Manufacturer: Murata; Manufacturer Part Number: GRM1555C1H1R6BA01D; Capacitance: 1.6pF; Voltage Rating: 50V; Dielectric: C0G; Supplier 1: Digi-Key; Supplier Part Number 1: 490-6214-1-ND; Stock 1: 77555; RoHS: Yes; Mount: Surface Mount; Case/Package: 0402; Case Code (Metric): 1005; Case Code (Imperial): 0402; Min Operating Temperature: -55°C; Max Operating Temperature: 125°C; Package Quantity: 1; Packaging: Tape and Reel; Voltage Rating (DC): 50V; Termination: SMD/SMT; Length: 1mm; Height: 0.5mm; Width: 0.02inch; Thickness: 0.022inch; Depth: 0.5mm; Radiation Hardening: No; ComponentLink1URL: https://datasheet.ciiva.com/6270/grm1555c1h1r6ba01-01-6270912.pdf?src-supplier=Digi-Key; ComponentLink1Description: https://datasheet.ciiva.com/6270/grm1555c1h1r6ba01-01-6270912.pdf?src-supplier=Digi-Key; ComponentLink2URL: https://datasheet.ciiva.com/18184/getdatasheetpartid-319318-18184245.pdf?src-supplier=Verical; ComponentLink2Description: https://datasheet.ciiva.com/18184/getdatasheetpartid-319318-18184245.pdf?src-supplier=Verical; ComponentLink3URL: https://datasheet.ciiva.com/11615/product-11615783.pdf?src-supplier=Avnet; ComponentLink3Description: https://datasheet.ciiva.com/11615/product-11615783.pdf?src-supplier=Avnet; ComponentLink4URL: https://datasheet.ciiva.com/5438/product-5438044.pdf?src-supplier=Mouser; ComponentLink4Description: https://datasheet.ciiva.com/5438/product-5438044.pdf?src-supplier=Mouser; ComponentLink5URL: https://datasheet.ciiva.com/6270/partnumbering-e-01-6270909.pdf?src-supplier=Digi-Key; ComponentLink5Description: https://datasheet.ciiva.com/6270/partnumbering-e-01-6270909.pdf?src-supplier=Digi-Key
C53 C68 C95 = CAP_120PF_50V_5%_C0G_0402: as C70 on sheet Power_Amplifier_HP; Manufacturer Part Number: C0402C121J5GACAUTO; ComponentLink1URL: https://content.kemet.com/datasheets/KEM_C1022_C0G_AUTO_SMD.pdf; ComponentLink1Description: http://search.murata.co.jp/Ceramy/image/img/A01X/G101/ENG/GRM0335C1H121JA01-01.pdf
J3 = MS-156HF: as J6 on sheet Power_Amplifier_HP; Supplier 1: Digi-Key; Supplier Part Number 1: H11669-ND; RoHS: RoHS Compliant; Category: Connectors, Interconnects; Stock 1: 10; Pricing 1: 1=0.84, 10=0.735, 25=0.6912, 50=0.6626, 100=0.6337, 250=0.57612, 500=0.51852, 1000=0.4609, 2500=0.41769 (EUR); Packaging: Bulk; Part Status: Active; Shield Termination: Solder; Mounting Type: Surface Mount; Cable Group: -; Fastening Type: Snap-On; Features: Internal Switch; Housing Color: Gold; Ingress Protection: -; Center Contact Plating: Gold; Voltage Rating: -; Operating Temperature: -40°C ~ 85°C; ComponentLink1URL: https://www.hirose.com/product/en/download_file/key_name/MS-156HF/category/Catalog/doc_file_id/49714/?file_category_id=4&item_id=394&is_series=1; ComponentLink1Description: https://www.hirose.com/product/en/download_file/key_name/MS-156HF/category/Catalog/doc_file_id/49714/?file_category_id=4&item_id=394&is_series=1; Supplier 2: Digi-Key; Supplier Part Number 2: 1173-1084-1-ND; Manufacturer 2: Anaren; Manufacturer Part Number 2: DC0710J5010AHF; Stock 2: 8788; Pricing 2: 1=0.82, 10=0.735, 25=0.648, 100=0.5833, 250=0.50772, 500=0.4537 (EUR); Applications: General Purpose; Isolation: -; Package / Case: 0805 (2012 Metric); Supplier Device Package: 0805; ComponentLink2URL: https://www.anaren.com/sites/default/files/Part-Datasheets/DC0710J5010AHF_Datasheet_RevA.pdf; ComponentLink2Description: https://www.anaren.com/sites/default/files/Part-Datasheets/DC0710J5010AHF_Datasheet_RevA.pdf; Manufacturer: Hirose Electric Co Ltd; Manufacturer Part Number: MS-156HF(01)
L11 = LQW15AN6N8G00D: FIXED IND 6.8NH 700MA 90 MOHM; Manufacturer: Murata Electronics North America; Type: Wirewound; Material - Core: Non-Magnetic; Tolerance: ±2%; Shielding: Unshielded; DC Resistance (DCR): 90 mOhm Max; Q @ Freq: 25 @ 250MHz; Exact Component Match: yes; Supplier 1: Digi-Key; Manufacturer Part Number: LQW15AN6N8G00D; RoHS: RoHS Compliant; Category: Inductors, Coils, Chokes; Stock: 89299; Pricing 1: 1=0.16, 10=0.145, 100=0.0967, 500=0.08054, 1000=0.06765, 2500=0.05798 (EUR); Packaging: Cut Tape (CT); Part Status: Active; Ratings: -; Operating Temperature: -55°C ~ 125°C; Mounting Type: Surface Mount; Package / Case: Nonstandard; Supplier Device Package: 0402 (1005 Metric); Size / Dimension: 0.039" L x 0.020" W (1.00mm x 0.50mm); Height - Seated (Max): 0.024" (0.60mm); ComponentLink1URL: http://search.murata.co.jp/Ceramy/image/img/P02/JELF243A-0050.pdf; ComponentLink1Description: http://search.murata.co.jp/Ceramy/image/img/P02/JELF243A-0050.pdf; Supplier Part Number 1: 490-6840-1-ND
L12 = LQW15AN5N6C10D: Inductor RF Chip Wirewound 6.2nH 0.2nH 100MHz 25Q-Factor 700mA 90mOhm DCR 0402 T/R; Manufacturer: Murata; Manufacturer Part Number: LQW15AN6N2C00D; Core Material: Non-Magnetic,Air,Ferrite; Tolerance: 3%; Shielding: Unshielded; Q Factor: 25; DC Resistance (DCR): 90mR; Self Resonant Frequency: 8GHz; Current: 540mA; Supplier 1: Digi-Key; Supplier Part Number 1: 490-6839-1-ND; Stock 1: 20182; RoHS: Yes; Mount: Surface Mount; Case/Package: 0402; Number of Pins: 2; Weight: 2.8E-05oz; Case Code (Metric): 1005; Case Code (Imperial): 0402; Min Operating Temperature: -55°C; Max Operating Temperature: 125°C; Packaging: Tape and Reel; Package Quantity: 10000; Inductance: 6.2nH; Current Rating: 700mA; Composition: Wirewound; Test Frequency: 100MHz; Max DC Current: 700mA; Termination: SMD/SMT; DC Current: 700mA; Military Standard: Not; Length: 1mm; Height: 0.5mm; Width: 0.02inch; Height - Seated (Max): 0.024inch; Depth: 0.7mm; Radiation Hardening: No; REACH SVHC: No SVHC; Lead Free: Lead Free; ComponentLink1URL: https://datasheet.ciiva.com/11799/0900766b8090d800-11799065.pdf?src-supplier=RSComponents; ComponentLink1Description: https://datasheet.ciiva.com/11799/0900766b8090d800-11799065.pdf?src-supplier=RSComponents; ComponentLink2URL: https://datasheet.ciiva.com/4977/product-4977157.pdf?src-supplier=Mouser; ComponentLink2Description: https://datasheet.ciiva.com/4977/product-4977157.pdf?src-supplier=Mouser; ComponentLink3URL: https://datasheet.ciiva.com/16207/l0075s0080lqw15a-00-16207917.pdf?src-supplier=Future+Electronics; ComponentLink3Description: https://datasheet.ciiva.com/16207/l0075s0080lqw15a-00-16207917.pdf?src-supplier=Future+Electronics
R26 = ERJ-2RKF75R0X: RES SMD 110 OHM 1% 1/10W 0402; Manufacturer: Panasonic; Manufacturer Part Number: ERJ-2RKF1100X; Power Rating: 100mW; Voltage Rating: 50V; Temperature Coefficient: 100ppm/°C; Supplier 1: Digi-Key; Supplier Part Number 1: P110LCT-ND; Stock 1: 182558; RoHS: Yes; Mount: Surface Mount; Case/Package: 0402; Weight: 2.8E-05oz; Case Code (Imperial): 0402; Case Code (Metric): 1005; Contact Plating: Tin; Min Operating Temperature: -55°C; Max Operating Temperature: 155°C; Packaging: Tape and Reel; Resistance: 110R; Tolerance: 1%; Package Quantity: 1; Composition: Thick Film; Termination: SMD/SMT; Number of Terminations: 2; Military Standard: Not; Max Power Dissipation: 100mW; Voltage Rating (DC): 50V; Features: Automotive AEC-Q200; Length: 1mm; Height: 0.35mm; Width: 0.5mm; Depth: 0.5mm; REACH SVHC: Unknown; Lead Free: Lead Free; ComponentLink1URL: https://datasheet.ciiva.com/11821/0900766b80f80784-11821164.pdf?src-supplier=RSComponents; ComponentLink1Description: https://datasheet.ciiva.com/11821/0900766b80f80784-11821164.pdf?src-supplier=RSComponents; ComponentLink2URL: https://datasheet.ciiva.com/43460/426256-43460279.pdf?src-supplier=Farnell; ComponentLink2Description: https://datasheet.ciiva.com/43460/426256-43460279.pdf?src-supplier=Farnell; ComponentLink3URL: https://datasheet.ciiva.com/28593/1678782-28593210.pdf?src-supplier=Element14; ComponentLink3Description: https://datasheet.ciiva.com/28593/1678782-28593210.pdf?src-supplier=Element14; ComponentLink4URL: https://datasheet.ciiva.com/46388/426256-46388475.pdf?src-supplier=Element14; ComponentLink4Description: https://datasheet.ciiva.com/46388/426256-46388475.pdf?src-supplier=Element14; ComponentLink5URL: https://datasheet.ciiva.com/16757/70260748-16757813.pdf?src-supplier=Allied+Electronics; ComponentLink5Description: https://datasheet.ciiva.com/16757/70260748-16757813.pdf?src-supplier=Allied+Electronics; ComponentLink6URL: https://datasheet.ciiva.com/28665/1678782-28665365.pdf?src-supplier=Element14; ComponentLink6Description: https://datasheet.ciiva.com/28665/1678782-28665365.pdf?src-supplier=Element14; ComponentLink7URL: https://datasheet.ciiva.com/24163/aoa0000ce2-24163366.pdf?src-supplier=Mouser; ComponentLink7Description: https://datasheet.ciiva.com/24163/aoa0000ce2-24163366.pdf?src-supplier=Mouser; ComponentLink8URL: https://datasheet.ciiva.com/30259/aoa0000ce2-30259596.pdf?src-supplier=Onlinecomponents.com; ComponentLink8Description: https://datasheet.ciiva.com/30259/aoa0000ce2-30259596.pdf?src-supplier=Onlinecomponents.com
R34 = RC0402JR-070RL: as R10 on sheet Power_Amplifier_HP; Supplier 1: Digi-Key; Supplier Part Number 1: 311-0.0JRDKR-ND; Manufacturer Part Number: RC0402JR-070RL; RoHS: RoHS Compliant; Category: Resistors; Stock 1: 13423202; Pricing 1: 1=0.09, 10=0.012, 25=0.0084, 100=0.0048, 250=0.0036, 500=0.00288, 1000=0.00212, 2500=0.00184, 5000=0.00152 (EUR); Packaging: Digi-Reel®; Part Status: Active; Tolerance: Jumper; Composition: Thick Film; Features: Moisture Resistant; Temperature Coefficient: -; Operating Temperature: -55°C ~ 155°C; Package / Case: 0402 (1005 Metric); Supplier Device Package: 0402; Size / Dimension: 0.039" L x 0.020" W (1.00mm x 0.50mm); Height - Seated (Max): 0.016" (0.40mm); Number of Terminations: 2; Failure Rate: -; ComponentLink1URL: http://www.yageo.com/NewPortal/yageodocoutput?fileName=/pdf/R-Chip/PYu-RC_Group_51_RoHS_L_4.pdf; ComponentLink1Description: http://www.yageo.com/NewPortal/yageodocoutput?fileName=/pdf/R-Chip/PYu-RC_Group_51_RoHS_L_4.pdf; Manufacturer 1: Yageo; Manufacturer Part Number 1: RC0402JR-070RL
R35 = RC0402FR-07100RL: as R21 on sheet Power_Amplifier_HP; Supplier 1: Digi-Key; Supplier Part Number 1: 311-100LRCT-ND; Manufacturer Part Number: RC0402FR-07100RL; RoHS: RoHS Compliant; Category: Resistors; Stock 1: 1895343; Pricing 1: 1=0.09, 10=0.012, 25=0.0088, 100=0.0049, 250=0.00372, 500=0.00296, 1000=0.00218, 2500=0.00189, 5000=0.00156 (EUR); Packaging: Cut Tape (CT); Part Status: Active; Tolerance: ±1%; Composition: Thick Film; Features: Moisture Resistant; Operating Temperature: -55°C ~ 155°C; Package / Case: 0402 (1005 Metric); Supplier Device Package: 0402; Size / Dimension: 0.039" L x 0.020" W (1.00mm x 0.50mm); Height - Seated (Max): 0.016" (0.40mm); Number of Terminations: 2; Failure Rate: -; ComponentLink1URL: http://www.yageo.com/NewPortal/yageodocoutput?fileName=/pdf/R-Chip/PYu-RC_Group_51_RoHS_L_4.pdf; ComponentLink1Description: http://www.yageo.com/NewPortal/yageodocoutput?fileName=/pdf/R-Chip/PYu-RC_Group_51_RoHS_L_4.pdf; Manufacturer 1: Yageo; Manufacturer Part Number 1: RC0402FR-07100RL
T4 = DC0710J5010AHF: Directional Coupler; Manufacturer: Anaren; Coupler Type: Standard; Frequency: 700MHz ~ 1GHz; Coupling Factor: 10.9dB; Insertion Loss: 0.21dB; Power - Max: 2W; Return Loss: 17.5dB; Exact Component Match: no; Supplier 1: Digi-Key; Supplier Part Number 1: 1173-1084-1-ND; Manufacturer Part Number: DC0710J5010AHF; RoHS: RoHS Compliant; Category: RF/IF and RFID; Stock: 28051; Pricing: 1=0.74, 10=0.654, 25=0.5904, 100=0.5167, 250=0.45344, 500=0.4007 (EUR); Packaging: Cut Tape (CT); Part Status: Active; Applications: General Purpose; Isolation: -; Package / Case: 0805 (2012 Metric); Supplier Device Package: 0805; ComponentLink1URL: https://cdn.anaren.com/product-documents/Xinger/DirectionalCouplers/DC0710J5010AHF/DC0710J5010AHF_DataSheet(Rev_B).pdf; ComponentLink1Description: https://cdn.anaren.com/product-documents/Xinger/DirectionalCouplers/DC0710J5010AHF/DC0710J5010AHF_DataSheet(Rev_B).pdf
T6 = BD0810J50100AHF: XFRMR BALUN RF 800-1000MHZ 0805; Manufacturer: Anaren; Frequency Range: 800MHz ~ 1GHz; Impedance - Unbalanced/Balanced: 50 / 100 Ohm; Phase Difference: 1°; Insertion Loss (Max): 0.95dB; Return Loss (Min): 13dB; Exact Component Match: no; Supplier Part Number 1: 1173-1056-2-ND; Supplier Part Number 2: 1173-1056-1-ND; Manufacturer Part Number: BD0810J50100AHF; RoHS: RoHS Compliant; Category: RF/IF and RFID; Stock: 9830; Pricing: 1=0.6, 10=0.587, 25=0.3928, 50=0.3494, 100=0.3201, 250=0.28724, 500=0.28124 (EUR); Packaging: Cut Tape (CT); Part Status: Active; Package / Case: 0805 (2012 Metric); Mounting Type: Surface Mount; ComponentLink1URL: https://cdn.anaren.com/product-documents/Xinger/BalunTransformers/BD0810J50100AHF/BD0810J50100AHF_DataSheet(Rev_E).pdf; ComponentLink1Description: https://cdn.anaren.com/product-documents/Xinger/BalunTransformers/BD0810J50100AHF/BD0810J50100AHF_DataSheet(Rev_E).pdf; Supplier 1: Digi-Key
U6-U8 = PE64906MLAA-Z: IC RF DTC 100-3000MHZ 10QFN; Manufacturer: Peregrine Semiconductor; Function: Digitally Tunable Capacitor; Frequency: 100MHz ~ 3GHz; RF Type: General Purpose; Secondary Attributes: SPI Interface; Exact Component Match: yes; Frequency - Lower: 500MHz; Isolation @ Frequency: 20dB @ 5.8GHz (typ); Insertion Loss @ Frequency: 0.8dB @ 5.8GHz; IIP3: 57dBm (typ); Circuit: SPDT; P1dB: 36dBm; Impedance: 50 Ohm; Voltage - Supply: 2.5 V ~ 5 V; Manufacturer Part Number: PE64906B-Z; RoHS: RoHS Compliant; Category: RF/IF and RFID; Packaging: Cut Tape (CT); Package / Case: 10-UFQFN Exposed Pad; ComponentLink1URL: http://www.psemi.com/pdf/datasheets/pe64906ds.pdf; ComponentLink1Description: http://www.psemi.com/pdf/datasheets/pe64906ds.pdf; Topology: -; Features: -; Operating Temperature: -40°C ~ 85°C; ComponentLink2URL: http://www.skyworksinc.com/uploads/documents/SKY13431_374LF_201649C.pdf; ComponentLink2Description: http://www.skyworksinc.com/uploads/documents/SKY13431_374LF_201649C.pdf

## Sheet Antenna_Switch_HP.SchDoc
size A; SheetNumber: 11; SheetTotal: 12; PageSetup: Record=PageOptions|CenterHorizontal=True|CenterVertical=True|PrintScale=0.97|XCorrection=1.00|YCorrection=1.00|PrintKind=0|BorderSize=5000000|LeftOffset=0|BottomOffset=0|Orientation=2|PaperLength=1000|PaperWidth=1000|Scale=100|PaperSource=7|PrintQuality=-4|MediaType=1|DitherType=10|PaperKind=A4|PrintScaleMode=1
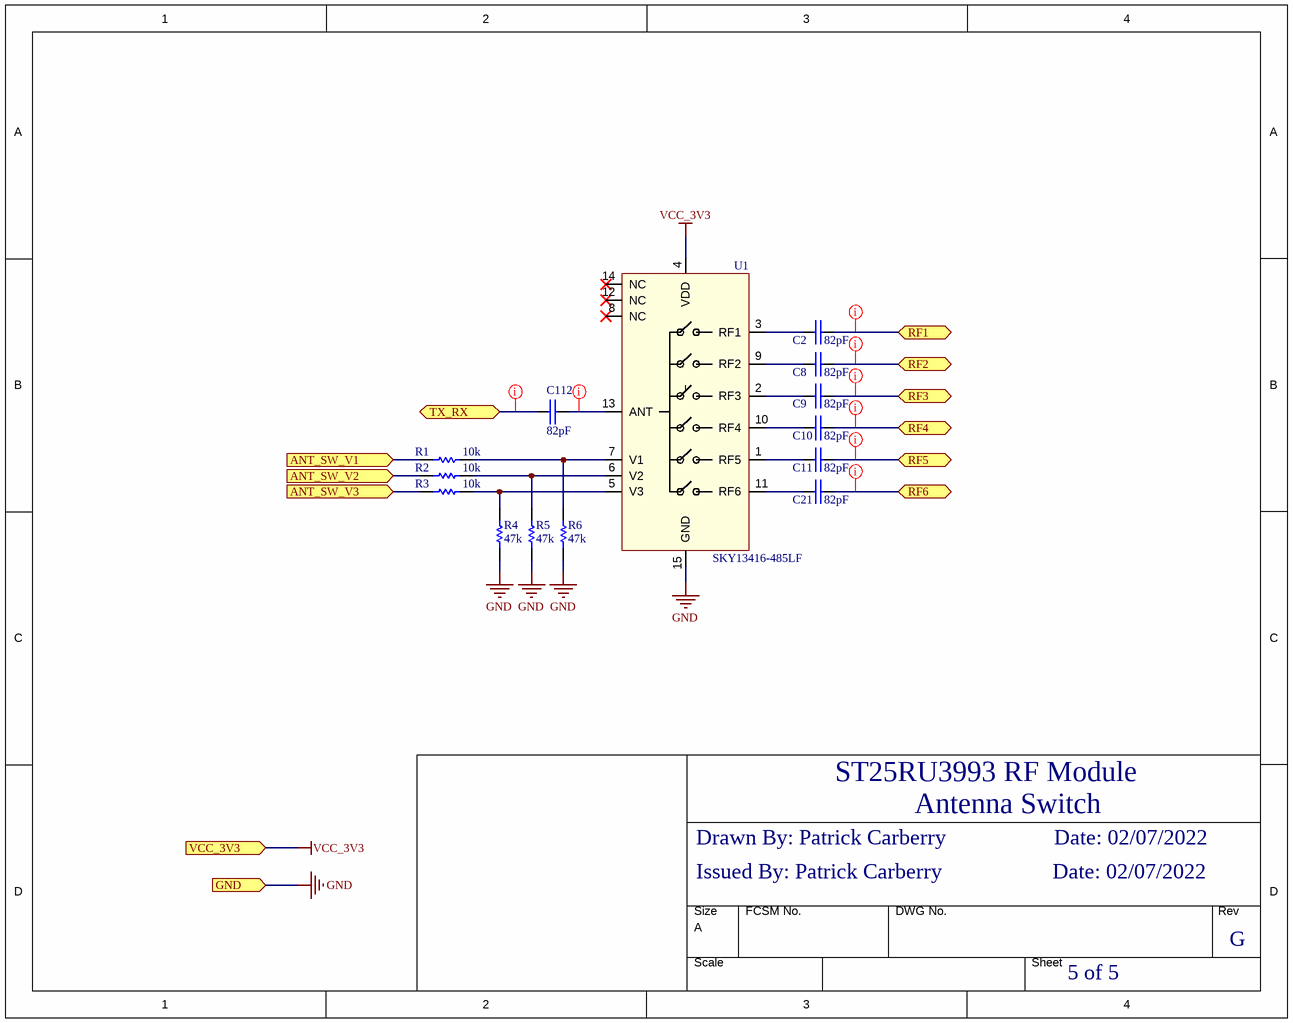
[diagram p4: Antenna_Switch_HP.SchDoc]

### Parts
C2  82pF  [C0402-RF]
C8  82pF  [C0402-RF]
C9  82pF  [C0402-RF]
C10  82pF  [C0402-RF]
C11  82pF  [C0402-RF]
C21  82pF  [C0402-RF]
C112  82pF  [C0402-RF]
R1  10k  [R0402-RF]
R2  10k  [R0402-RF]
R3  10k  [R0402-RF]
R4  47k  [R0402-RF]
R5  47k  [R0402-RF]
R6  47k  [R0402-RF]
U1  SKY13416-485LF  [SKY13416485LF]

### Ports
ANT_SW_V1 (in), ANT_SW_V2 (in), ANT_SW_V3 (in), GND (in), RF1 (bidir), RF2 (bidir), RF3 (bidir), RF4 (bidir), RF5 (bidir), RF6 (bidir), TX_RX (bidir), VCC_3V3 (in)

### Nets
GND: R4.1 R5.1 R6.1 U1.15(GND) ; port GND
VCC_3V3: U1.4(VDD) ; port VCC_3V3
ANT_SW_V1: R1.1 ; port ANT_SW_V1
ANT_SW_V2: R2.1 ; port ANT_SW_V2
ANT_SW_V3: R3.1 ; port ANT_SW_V3
NetANT1_IN: C11.2 ; port RF5
NetANT2_IN: C9.2 ; port RF3
NetANT3_IN: C2.2 ; port RF1
NetANT4_IN: C21.2 ; port RF6
NetANT5_IN: C10.2 ; port RF4
NetANT6_IN: C8.2 ; port RF2
NetC2_1: C2.1 U1.3(RF1)
NetC8_1: C8.1 U1.9(RF2)
NetC9_1: C9.1 U1.2(RF3)
NetC10_1: C10.1 U1.10(RF4)
NetC11_1: C11.1 U1.1(RF5)
NetC21_1: C21.1 U1.11(RF6)
NetC112_1: C112.1 U1.13(ANT)
NetC112_2: C112.2 ; port TX_RX
NetR1_2: R1.2 R6.2 U1.7(V1)
NetR2_2: R2.2 R5.2 U1.6(V2)
NetR3_2: R3.2 R4.2 U1.5(V3)

Not connected (* = marked no-connect by the designer): U1 8(NC)* 12(NC)* 14(NC)*

### Layout directives
net class SE_CPWG: NetANT1_IN, NetANT2_IN, NetANT3_IN, NetANT4_IN, NetANT5_IN, NetANT6_IN, NetC112_1, NetC112_2

### Notes on the sheet
- ST25RU3993 RF Module
- Antenna Switch
- Drawn By: Patrick Carberry
- Issued By: Patrick Carberry
- Date: 02/07/2022
- G
- 5 of 5

### Library data of the parts
C2 C8-C11 C21 C112 = GRM1555C1H820GA01J: as C107 on sheet Power_Amplifier_HP; Supplier 1: Digi-Key; Supplier Part Number 1: 490-7760-1-ND; Manufacturer Part Number: GRM1555C1H820GA01J; RoHS: RoHS Compliant; Category: Capacitors; Stock: 52112; Pricing: 1=0.08, 10=0.042, 100=0.0189, 500=0.01352, 1000=0.01063, 2500=0.00966, 5000=0.00889 (EUR); Packaging: Cut Tape (CT); Part Status: Active; Voltage - Rated: 50V; Operating Temperature: -55°C ~ 125°C; Features: -; Ratings: -; Applications: General Purpose; Mounting Type: Surface Mount, MLCC; Package / Case: 0402 (1005 Metric); Size / Dimension: 0.039" L x 0.020" W (1.00mm x 0.50mm); Height - Seated (Max): -; Thickness (Max): 0.022" (0.55mm); Lead Spacing: -; Lead Style: -; ComponentLink1URL: http://www.murata.com/~/media/webrenewal/support/library/catalog/products/capacitor/mlcc/c02e.ashx; ComponentLink1Description: http://www.murata.com/~/media/webrenewal/support/library/catalog/products/capacitor/mlcc/c02e.ashx; Supplier 2: Digi-Key; Supplier Part Number 2: 490-3999-1-ND; Height (Max): 0.022" (0.55mm); ComponentLink2URL: http://www.murata.com/en-global/products/productdata/8796740223006/ENFA0024.pdf; ComponentLink2Description: http://www.murata.com/en-global/products/productdata/8796740223006/ENFA0024.pdf; Supplier 3: Digi-Key; Supplier Part Number 3: 497-13413-1-ND; Supplier Device Package: SOD-882T; ComponentLink3URL: http://www.st.com/content/ccc/resource/technical/document/datasheet/e8/d2/ed/fd/e8/00/4a/29/DM00065056.pdf/files/DM00065056.pdf/jcr:content/translations/en.DM00065056.pdf; ComponentLink3Description: http://www.st.com/content/ccc/resource/technical/document/datasheet/e8/d2/ed/fd/e8/00/4a/29/DM00065056.pdf/files/DM00065056.pdf/jcr:content/translations/en.DM00065056.pdf; Exact Component Match: no
R1-R3 = RC0402FR-0710KL: RES SMD 10K OHM 1% 1/16W 0402; Manufacturer 1: Yageo; Power (Watts): 0.063W, 1/16W; Temperature Coefficient: ±100ppm/°C; Exact Component Match: no; Supplier 1: Digi-Key; Supplier Part Number 1: 311-10.0KLRCT-ND; Manufacturer Part Number 1: RC0402FR-0710KL; RoHS: RoHS Compliant; Category: Resistors; Stock 1: 12117181; Pricing 1: 1=0.09, 10=0.012, 25=0.0088, 100=0.0049, 250=0.00372, 500=0.00296, 1000=0.00218, 2500=0.00189, 5000=0.00156 (EUR); Packaging: Cut Tape (CT); Part Status: Active; Resistance (Ohms): 10k; Tolerance: ±1%; Composition: Thick Film; Features: Moisture Resistant; Operating Temperature: -55°C ~ 155°C; Package / Case: 0402 (1005 Metric); Supplier Device Package: 0402; Size / Dimension: 0.039" L x 0.020" W (1.00mm x 0.50mm); Height - Seated (Max): 0.016" (0.40mm); Number of Terminations: 2; Failure Rate: -; ComponentLink1URL: http://www.yageo.com/NewPortal/yageodocoutput?fileName=/pdf/R-Chip/PYu-RC_Group_51_RoHS_L_4.pdf; ComponentLink1Description: http://www.yageo.com/NewPortal/yageodocoutput?fileName=/pdf/R-Chip/PYu-RC_Group_51_RoHS_L_4.pdf; Manufacturer: Yageo; Manufacturer Part Number: RC0402FR-0710KL
R4-R6 = RC0402FR-0747KL: RES SMD 47K OHM 1% 1/16W 0402; Manufacturer 1: Yageo; Power (Watts): 0.063W, 1/16W; Temperature Coefficient: ±100ppm/°C; Exact Component Match: no; Supplier 1: Digi-Key; Supplier Part Number 1: 311-47.0KLRCT-ND; Manufacturer Part Number 1: RC0402FR-0747KL; RoHS: RoHS Compliant; Category: Resistors; Stock 1: 2403458; Pricing 1: 1=0.09, 10=0.012, 25=0.0088, 100=0.0049, 250=0.00372, 500=0.00296, 1000=0.00218, 2500=0.00189, 5000=0.00156 (EUR); Packaging: Cut Tape (CT); Part Status: Active; Resistance (Ohms): 47k; Tolerance: ±1%; Composition: Thick Film; Features: Moisture Resistant; Operating Temperature: -55°C ~ 155°C; Package / Case: 0402 (1005 Metric); Supplier Device Package: 0402; Size / Dimension: 0.039" L x 0.020" W (1.00mm x 0.50mm); Height - Seated (Max): 0.016" (0.40mm); Number of Terminations: 2; Failure Rate: -; ComponentLink1URL: http://www.yageo.com/NewPortal/yageodocoutput?fileName=/pdf/R-Chip/PYu-RC_Group_51_RoHS_L_4.pdf; ComponentLink1Description: http://www.yageo.com/NewPortal/yageodocoutput?fileName=/pdf/R-Chip/PYu-RC_Group_51_RoHS_L_4.pdf; Manufacturer: Yageo; Manufacturer Part Number: RC0402FR-0747KL
U1 = SKY13416-485LF: RF Switch IC SP6T 3GHz 50Ohm 14-QFN (2x2); Manufacturer: Skyworks Solutions; Manufacturer Part Number: SKY13416-485LF; ComponentLink1Description: Datasheet; ComponentLink1URL: https://www.skyworksinc.com/-/media/SkyWorks/Documents/Products/701-800/SKY13416_485LF_201679I.pdf